# EAGLE schematic keyboard (EAGLE 9.2.2)
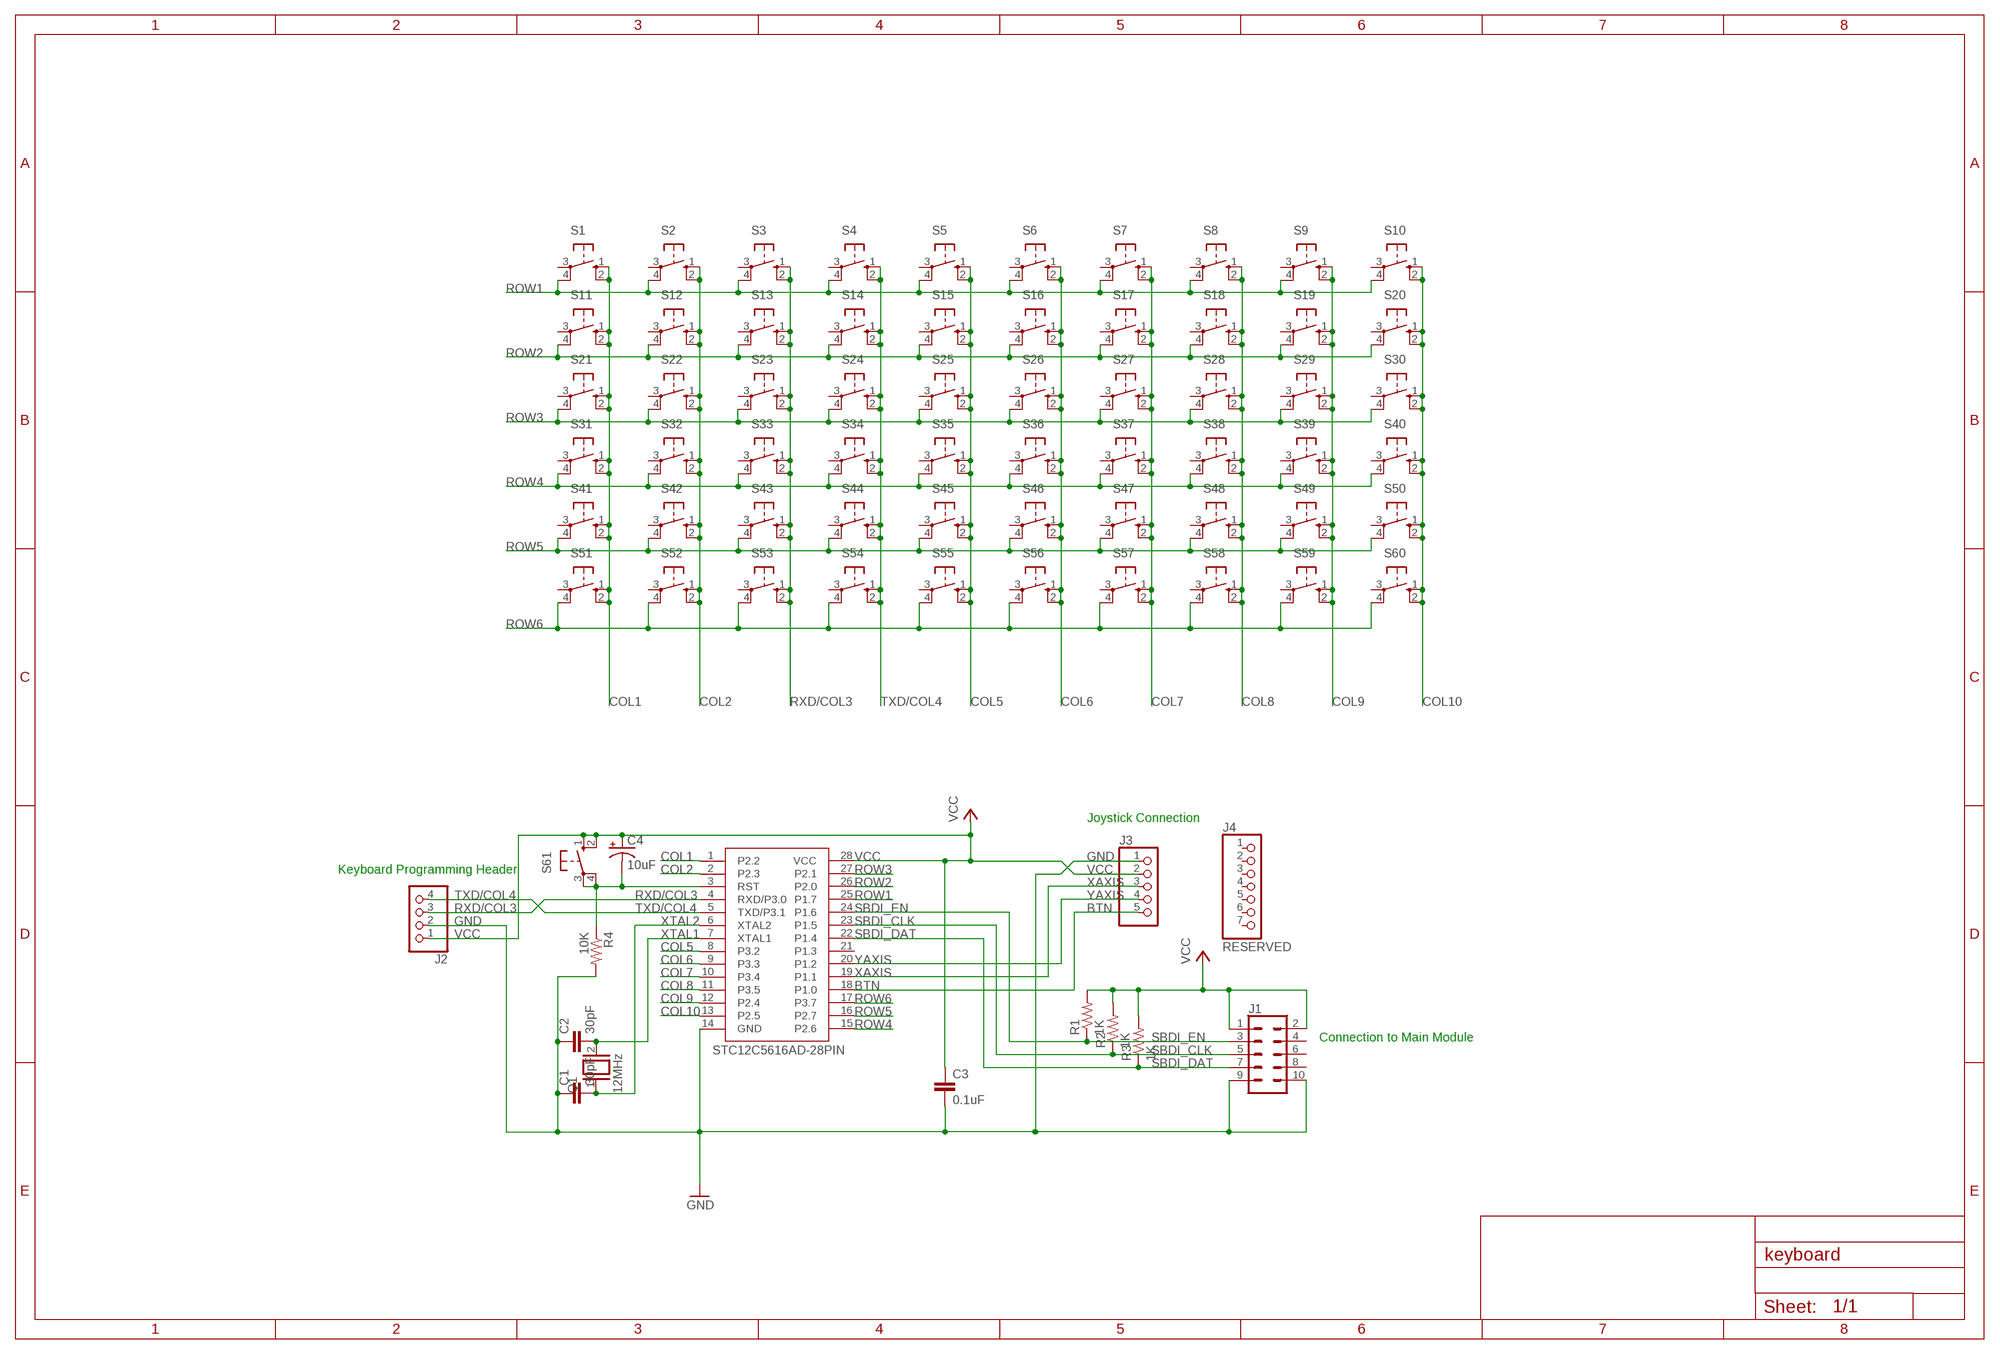
[diagram p0: schematic, sheet 1]

## Parts
C1  30pF  C-EU025-025X050  [C025-025X050]
C2  30pF  C-EU025-025X050  [C025-025X050]
C3  0.1uF  C-EU025-030X050  [C025-030X050]
C4  10uF  CPOL-USE1.8-4  [E1,8-4]
IC1  STC12C5616AD  STC12C5616AD-28PIN  [DIP787W45P254L3505H508Q28B]
J1  CONN_05X2SHD_LOCK  [2X5-SHROUDED_LOCK]
J2  PINHD-1X4  [1X04]
J3  PINHD-1X5  [1X05]
J4  RESERVED  PINHD-1X7  [1X07]
Q1  12MHz  XTAL/S  [QS]
R1  1K  R-US_0204/7  [0204/7]
R2  1K  R-US_0204/7  [0204/7]
R3  1K  R-US_0204/7  [0204/7]
R4  10K  R-US_0204/7  [0204/7]
S1  10-XX  [B3F-10XX]
S2  10-XX  [B3F-10XX]
S3  10-XX  [B3F-10XX]
S4  10-XX  [B3F-10XX]
S5  10-XX  [B3F-10XX]
S6  10-XX  [B3F-10XX]
S7  10-XX  [B3F-10XX]
S8  10-XX  [B3F-10XX]
S9  10-XX  [B3F-10XX]
S10  10-XX  [B3F-10XX]
S11  10-XX  [B3F-10XX]
S12  10-XX  [B3F-10XX]
S13  10-XX  [B3F-10XX]
S14  10-XX  [B3F-10XX]
S15  10-XX  [B3F-10XX]
S16  10-XX  [B3F-10XX]
S17  10-XX  [B3F-10XX]
S18  10-XX  [B3F-10XX]
S19  10-XX  [B3F-10XX]
S20  10-XX  [B3F-10XX]
S21  10-XX  [B3F-10XX]
S22  10-XX  [B3F-10XX]
S23  10-XX  [B3F-10XX]
S24  10-XX  [B3F-10XX]
S25  10-XX  [B3F-10XX]
S26  10-XX  [B3F-10XX]
S27  10-XX  [B3F-10XX]
S28  10-XX  [B3F-10XX]
S29  10-XX  [B3F-10XX]
S30  10-XX  [B3F-10XX]
S31  10-XX  [B3F-10XX]
S32  10-XX  [B3F-10XX]
S33  10-XX  [B3F-10XX]
S34  10-XX  [B3F-10XX]
S35  10-XX  [B3F-10XX]
S36  10-XX  [B3F-10XX]
S37  10-XX  [B3F-10XX]
S38  10-XX  [B3F-10XX]
S39  10-XX  [B3F-10XX]
S40  10-XX  [B3F-10XX]
S41  10-XX  [B3F-10XX]
S42  10-XX  [B3F-10XX]
S43  10-XX  [B3F-10XX]
S44  10-XX  [B3F-10XX]
S45  10-XX  [B3F-10XX]
S46  10-XX  [B3F-10XX]
S47  10-XX  [B3F-10XX]
S48  10-XX  [B3F-10XX]
S49  10-XX  [B3F-10XX]
S50  10-XX  [B3F-10XX]
S51  10-XX  [B3F-10XX]
S52  10-XX  [B3F-10XX]
S53  10-XX  [B3F-10XX]
S54  10-XX  [B3F-10XX]
S55  10-XX  [B3F-10XX]
S56  10-XX  [B3F-10XX]
S57  10-XX  [B3F-10XX]
S58  10-XX  [B3F-10XX]
S59  10-XX  [B3F-10XX]
S60  10-XX  [B3F-10XX]
S61  10-XX  [B3F-10XX]

## Nets
BTN: IC1.18(P1.0) J3.5
COL1: IC1.1(P2.2) S1.1(S) S1.2(S1) S11.1(S) S11.2(S1) S21.1(S) S21.2(S1) S31.1(S) S31.2(S1) S41.1(S) S41.2(S1) S51.1(S) S51.2(S1)
COL2: IC1.2(P2.3) S2.1(S) S2.2(S1) S12.1(S) S12.2(S1) S22.1(S) S22.2(S1) S32.1(S) S32.2(S1) S42.1(S) S42.2(S1) S52.1(S) S52.2(S1)
COL5: IC1.8(P3.2) S5.1(S) S5.2(S1) S15.1(S) S15.2(S1) S25.1(S) S25.2(S1) S35.1(S) S35.2(S1) S45.1(S) S45.2(S1) S55.1(S) S55.2(S1)
COL6: IC1.9(P3.3) S6.1(S) S6.2(S1) S16.1(S) S16.2(S1) S26.1(S) S26.2(S1) S36.1(S) S36.2(S1) S46.1(S) S46.2(S1) S56.1(S) S56.2(S1)
COL7: IC1.10(P3.4) S7.1(S) S7.2(S1) S17.1(S) S17.2(S1) S27.1(S) S27.2(S1) S37.1(S) S37.2(S1) S47.1(S) S47.2(S1) S57.1(S) S57.2(S1)
COL8: IC1.11(P3.5) S8.1(S) S8.2(S1) S18.1(S) S18.2(S1) S28.1(S) S28.2(S1) S38.1(S) S38.2(S1) S48.1(S) S48.2(S1) S58.1(S) S58.2(S1)
COL9: IC1.12(P2.4) S9.1(S) S9.2(S1) S19.1(S) S19.2(S1) S29.1(S) S29.2(S1) S39.1(S) S39.2(S1) S49.1(S) S49.2(S1) S59.1(S) S59.2(S1)
COL10: IC1.13(P2.5) S10.1(S) S10.2(S1) S20.1(S) S20.2(S1) S30.1(S) S30.2(S1) S40.1(S) S40.2(S1) S50.1(S) S50.2(S1) S60.1(S) S60.2(S1)
GND: C1.1 C2.1 C3.2 IC1.14(GND) J1.9 J1.10 J2.2 J3.1 R4.2
N$2: C4.- IC1.3(RST) R4.1 S61.3(P) S61.4(P1)
ROW1: IC1.25(P1.7) S1.4(P1) S2.4(P1) S3.4(P1) S4.4(P1) S5.4(P1) S6.4(P1) S7.4(P1) S8.4(P1) S9.4(P1) S10.4(P1)
ROW2: IC1.26(P2.0) S11.4(P1) S12.4(P1) S13.4(P1) S14.4(P1) S15.4(P1) S16.4(P1) S17.4(P1) S18.4(P1) S19.4(P1) S20.4(P1)
ROW3: IC1.27(P2.1) S21.4(P1) S22.4(P1) S23.4(P1) S24.4(P1) S25.4(P1) S26.4(P1) S27.4(P1) S28.4(P1) S29.4(P1) S30.4(P1)
ROW4: IC1.15(P2.6) S31.4(P1) S32.4(P1) S33.4(P1) S34.4(P1) S35.4(P1) S36.4(P1) S37.4(P1) S38.4(P1) S39.4(P1) S40.4(P1)
ROW5: IC1.16(P2.7) S41.4(P1) S42.4(P1) S43.4(P1) S44.4(P1) S45.4(P1) S46.4(P1) S47.4(P1) S48.4(P1) S49.4(P1) S50.4(P1)
ROW6: IC1.17(P3.7) S51.4(P1) S52.4(P1) S53.4(P1) S54.4(P1) S55.4(P1) S56.4(P1) S57.4(P1) S58.4(P1) S59.4(P1) S60.4(P1)
RXD/COL3: IC1.4(RXD/P3.0) J2.3 S3.1(S) S3.2(S1) S13.1(S) S13.2(S1) S23.1(S) S23.2(S1) S33.1(S) S33.2(S1) S43.1(S) S43.2(S1) S53.1(S) S53.2(S1)
SBDI_CLK: IC1.23(P1.5) J1.5 R2.1
SBDI_DAT: IC1.22(P1.4) J1.7 R3.1
SBDI_EN: IC1.24(P1.6) J1.3 R1.1
TXD/COL4: IC1.5(TXD/P3.1) J2.4 S4.1(S) S4.2(S1) S14.1(S) S14.2(S1) S24.1(S) S24.2(S1) S34.1(S) S34.2(S1) S44.1(S) S44.2(S1) S54.1(S) S54.2(S1)
VCC: C3.1 C4.+ IC1.28(VCC) J1.1 J1.2 J2.1 J3.2 R1.2 R2.2 R3.2 S61.1(S) S61.2(S1)
XAXIS: IC1.19(P1.1) J3.3
XTAL1: C2.2 IC1.7(XTAL1) Q1.2
XTAL2: C1.2 IC1.6(XTAL2) Q1.1
YAXIS: IC1.20(P1.2) J3.4
Unconnected: IC1.21(P1.3) J1.4 J1.6 J1.8 J4.1 J4.2 J4.3 J4.4 J4.5 J4.6 J4.7 S1.3(P) S2.3(P) S3.3(P) S4.3(P) S5.3(P) S6.3(P) S7.3(P) S8.3(P) S9.3(P) S10.3(P) S11.3(P) S12.3(P) S13.3(P) S14.3(P) S15.3(P) S16.3(P) S17.3(P) S18.3(P) S19.3(P) S20.3(P) S21.3(P) S22.3(P) S23.3(P) S24.3(P) S25.3(P) S26.3(P) S27.3(P) S28.3(P) S29.3(P) S30.3(P) S31.3(P) S32.3(P) S33.3(P) S34.3(P) S35.3(P) S36.3(P) S37.3(P) S38.3(P) S39.3(P) S40.3(P) S41.3(P) S42.3(P) S43.3(P) S44.3(P) S45.3(P) S46.3(P) S47.3(P) S48.3(P) S49.3(P) S50.3(P) S51.3(P) S52.3(P) S53.3(P) S54.3(P) S55.3(P) S56.3(P) S57.3(P) S58.3(P) S59.3(P) S60.3(P)

## Notes on the sheet
- Joystick Connection
- Keyboard Programming Header
- Connection to Main Module

## Library data of the parts
C1-C3 = rcl:C-EU: CAPACITOR, European symbol; SPICEPREFIX: C
C4 = rcl:CPOL-US: POLARIZED CAPACITOR, American symbol; SPICEPREFIX: C
IC1 = TCalc:STC12C5616AD-28PIN
J1 = SparkFun-Connectors:CONN_05X2: Multi connection point. Often used as Generic Header-pin footprint for 0.1 inch spaced/style header connections For AVR SPI programming port, see special device with nice symbol: "AVR_SPI_PROG_5x2.dev" You can populate with any combo of single row headers, but if you'd like an exact match, check these: 2x5 AVR ICSP Male Header <https://www.sparkfun.com/products/778> (PRT-00778) 2x5 Pin Shrouded Header <https://www.sparkfun.com/products/8506> (PRT-08506) On any of the 0.1 inch spaced packages, you can populate with these: Break Away Headers - Straight <https://www.sparkfun.com/products/116> (PRT-00116) Break Away Male Headers - Right Angle <https://www.sparkfun.com/products/553> (PRT-00553) Female Headers <https://www.sparkfun.com/products/115> (PRT-00115) Break Away Headers - Machine Pin <https://www.sparkfun.com/products/117> (PRT-00117) Break Away Female Headers - Swiss Machine Pin <https://www.sparkfun.com/products/743> (PRT-00743) Special note: the shrouded connector mates well with our 5x2 ribbon cables: 2x5 Pin IDC Ribbon Cable <https://www.sparkfun.com/products/8535> (PRT-08535); PROD_ID: CONN-08671; SF_ID: PRT-08506
J2 = pinhead:PINHD-1X4: PIN HEADER
J3 = pinhead:PINHD-1X5: PIN HEADER
J4 = pinhead:PINHD-1X7: PIN HEADER
Q1 = special:XTAL/S: CRYSTAL
R1-R4 = rcl:R-US_: RESISTOR, American symbol; SPICEPREFIX: R
S1-S61 = switch-omron:10-XX: OMRON SWITCH; MPN: B3F-1000; OC_FARNELL: 176432; OC_NEWARK: 36M3542